# EAGLE design wire (EAGLE 6.5.0)
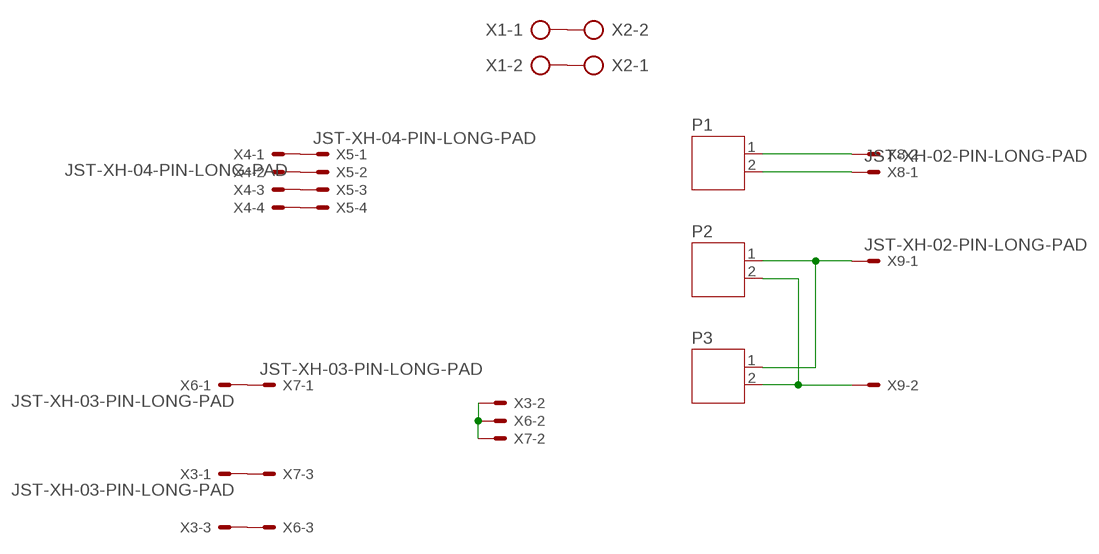
[diagram p0: schematic, sheet 1]

## Parts
P1  JST-PH2  [JST-PH2]
P2  JST-PH2  [JST-PH2]
P3  JST-PH2  [JST-PH2]
X1  AK500/2  [AK500/2]
X2  AK500/2  [AK500/2]
X3  JST-XH-03-PIN-LONG-PAD  [JST-XH-03-PACKAGE-LONG-PAD]
X4  JST-XH-04-PIN-LONG-PAD  [JST-XH-04-PACKAGE-LONG-PAD]
X5  JST-XH-04-PIN-LONG-PAD  [JST-XH-04-PACKAGE-LONG-PAD]
X6  JST-XH-03-PIN-LONG-PAD  [JST-XH-03-PACKAGE-LONG-PAD]
X7  JST-XH-03-PIN-LONG-PAD  [JST-XH-03-PACKAGE-LONG-PAD]
X8  JST-XH-02-PIN-LONG-PAD  [JST-XH-02-PACKAGE-LONG-PAD]
X9  JST-XH-02-PIN-LONG-PAD  [JST-XH-02-PACKAGE-LONG-PAD]

## Nets
N$1: X4.1 X5.1
N$2: P2.1 P3.1 X9.1
N$3: X4.2 X5.2
N$4: X4.3 X5.3
N$5: X4.4 X5.4
N$6: P2.2 P3.2 X9.2
N$7: X1.1 X2.2
N$8: X1.2 X2.1
N$11: P1.1 X8.2
N$12: P1.2 X8.1
N$13: X6.1 X7.1
N$14: X3.2 X6.2 X7.2
N$15: X3.1 X7.3
N$16: X3.3 X6.3

## Library data of the parts
P1-P3 = jst-ph:JST-PH2
X1 X2 = con-ptr500:AK500/2: CONNECTOR; OC_FARNELL: unknown; OC_NEWARK: unknown
X3 X6 X7 = Rembrandt Electronics - JST XH Connectors v1-0:JST-XH-03-PIN: JST XH Connector 2 Pin Wire to board connector. Pitch: 2,54 mm, (0.100") Number of pins: 3 Created by Rembrandt Electronics www.rembrandtelectronics.com
X4 X5 = Rembrandt Electronics - JST XH Connectors v1-0:JST-XH-04-PIN: JST XH Connector 2 Pin Wire to board connector. Pitch: 2,54 mm, (0.100") Number of pins: 4 Created by Rembrandt Electronics www.rembrandtelectronics.com
X8 X9 = Rembrandt Electronics - JST XH Connectors v1-0:JST-XH-02-PIN: JST XH Connector 2 Pin Wire to board connector. Pitch: 2,54 mm, (0.100") Number of pins: 2 Created by Rembrandt Electronics www.rembrandtelectronics.com

## Board
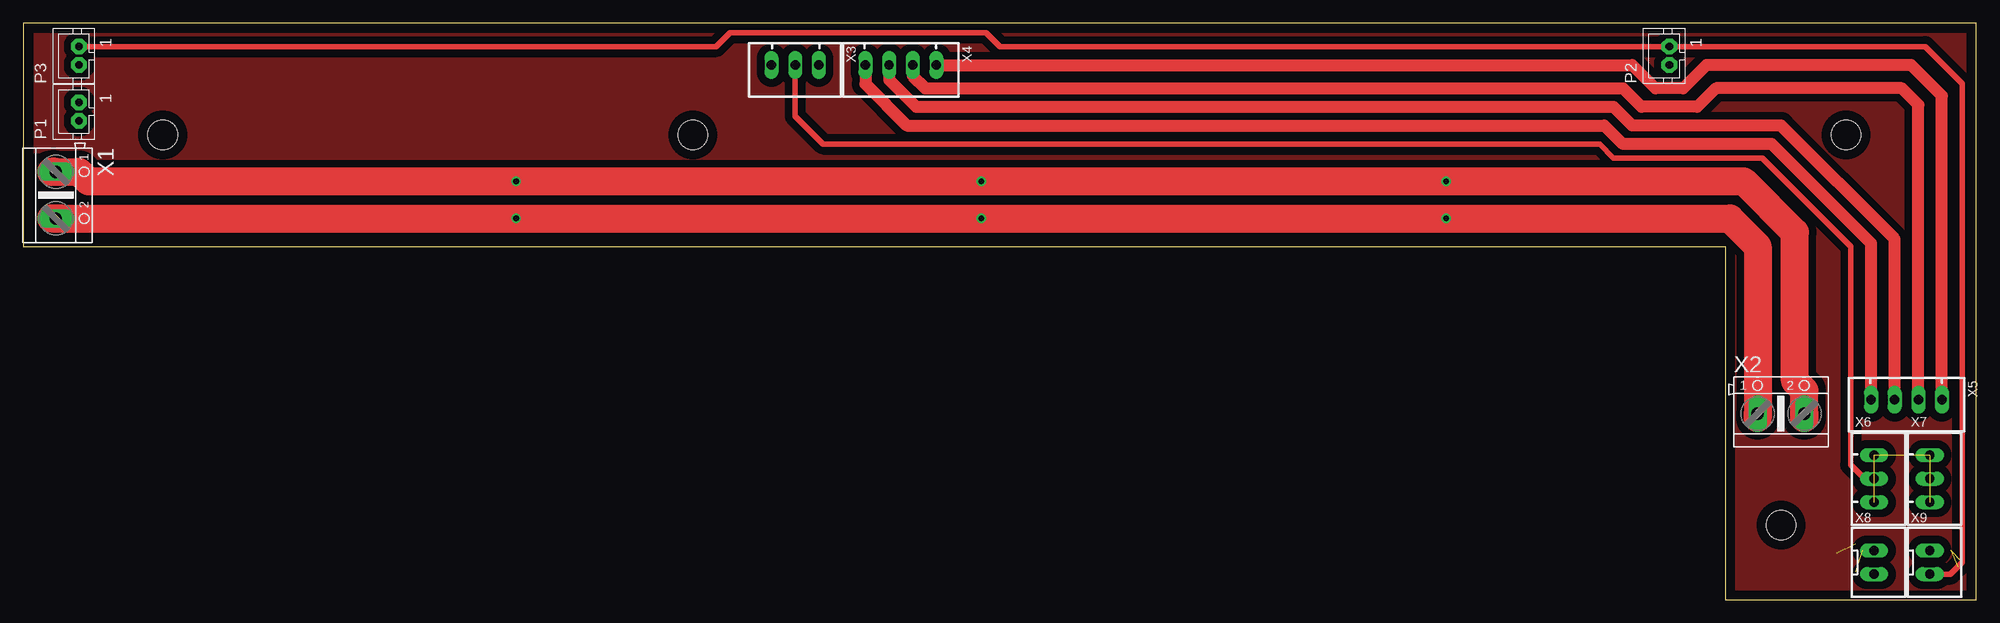
[diagram p1: board, top side]
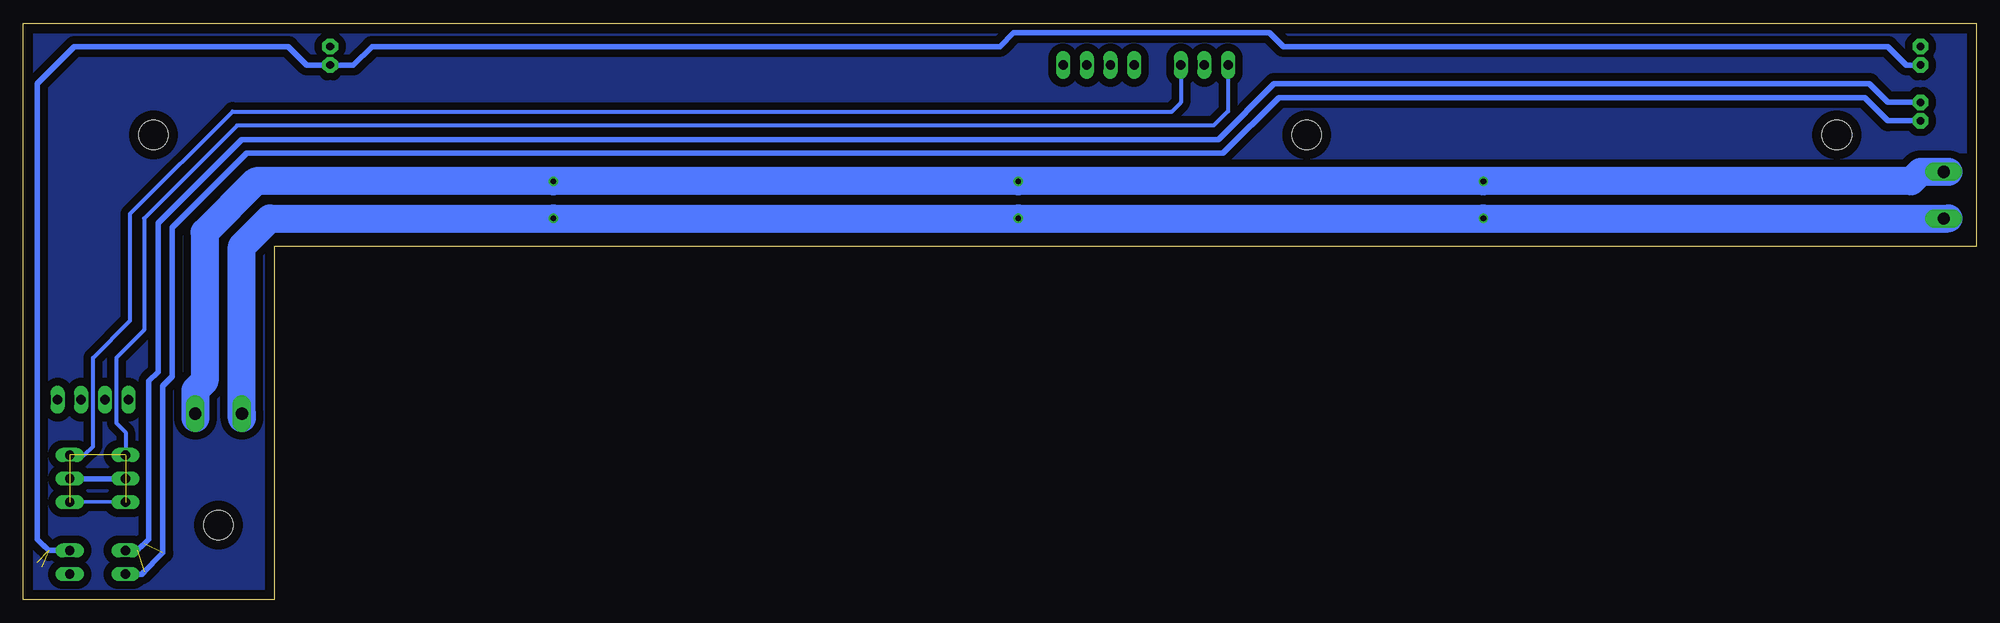
[diagram p2: board, bottom side, seen from below]

Size 210 x 62 mm. Coordinates in mm from the lower left corner, seen from the top.
Outline: 0,38 183,38 183,0 210,0 210,62 0,62 0,38
Copper layers (1*16): Top 0.035mm / dielectric 1.5mm / Bottom 0.035mm
Design rules "default": minimum track width 10mil, minimum drill 24mil, track to track 8mil, track to pad 8mil, pad to pad 8mil, via to via 8mil, smd to smd 8mil, copper to edge 40mil, drill to drill 8mil, minimum pad ring 10mil, minimum via ring 8mil, stop-mask expansion 4mil, vias tented up to drill 0mil, thermal gap 10mil
Holes 3.2 mm at 196,50 15,50 72,50 189,8

### Footprints (pad centres in the part's own frame; a part is rotated, then mirrored left to right if it is on the bottom)
JST-PH2 = drill 0.813 pad 1.676 octagon: 1 1,0; 2 -1,0
AK500/2 = drill 1.321 long: 1 -2.515,0; 2 2.515,0
JST-XH-03-PACKAGE-LONG-PAD = drill 1.016 long: 1 -2.54,0; 2 0,0; 3 2.54,0
JST-XH-04-PACKAGE-LONG-PAD = drill 1.016 long: 1 -3.81,0; 2 -1.27,0; 3 1.27,0; 4 3.81,0
JST-XH-02-PACKAGE-LONG-PAD = drill 1.016 long: 1 -1.27,0; 2 1.27,0

### Placement (x,y rotation side)
P1  6,52.5 90 top
P2  177,58.5 90 top
P3  6,58.5 90 top
X1  3.5,43.5 270 top
X2  189,20 0 top
X3  83,57.5 180 top
X4  94.36,57.5 180 top
X5  202.5,21.5 180 top
X6  199,13 270 top
X7  205,13 270 top
X8  199,4 270 top
X9  205,4 270 top

### Tracks (layer width: path | path; a pad name or v marks a point on that pad's centre or on a via)
N$1
  Top 1.27: X4.1 173,57.5 175.5,55 178.5,55 181,57.5 203,57.5 206.31,54.19 X5.1
N$2  (1 unrouted)
  Top 0.61: P3.1 74.5,59.5 76,61 103.5,61 105,59.5 P2.1 204.5,59.5 208.5,55.5 208.5,4 207.23,2.73
  Bottom 0.61: X9.1 207.27,5.27 208,6
N$3
  Top 1.27: X5.2 203.77,53.23 202,55 182,55 180,53 174,53 172,55 97,55 95.64,56.36 X4.2
N$4
  Top 1.27: X4.3 93.09,55.91 96,53 171,53 173,51 189,51 201.23,38.77 X5.3
N$5
  Top 1.27: X4.4 90.56,55.45 95,51 170,51 172,49 188,49 198.69,38.31 X5.4
N$6  (1 unrouted)
  Top 0.61: X9.2 207.23,2.73 208,3.5
  Bottom 0.61: P3.2 7.5,57.5 9.5,59.5 74.5,59.5 76,61 103.5,61 105,59.5 172.5,59.5 174.5,57.5 P2.2 179.5,57.5 181.5,59.5 204.5,59.5 208.5,55.5 208.5,6.5 207.27,5.27
N$7
  Top 3: X1.1 3.02,46.02 3,46 5.99,46.02 7,45 184.99,45.02 190.51,39.48 190.5,23.5 191.51,22.48 191.51,19.52 191.5,19.5 X2.2
N$8
  Top 3: X1.2 183.51,40.98 186.5,38 186.5,19.5 186.5,20.02 X2.1
N$11  (1 unrouted)
  Bottom 0.61: P1.1 9.5,53.5 11.5,55.5 75.5,55.5 81.5,49.5 186.5,49.5 195.5,40.5 195.5,24.5 196.5,23.5 196.5,6.5 197.73,5.27 | X8.2 197.27,2.73 197,3
N$12  (1 unrouted)
  Bottom 0.61: P1.2 9.5,51.5 12,54 75,54 81,48 186,48 194,40 194,24 195,23 195,5 197.27,2.73 | X8.1 197.73,5.27 197,6
N$13  (1 unrouted)
N$14
  Top 0.61: X3.2 83,52 86,49 169.5,49 171,47.5 187,47.5 196.5,38 196.5,14.5 198,13 X6.2
  Bottom 0.61: X6.2 X7.2
N$15  (1 unrouted)
  Bottom 0.406: X3.1 85.54,53.46 86.5,52.5 187.5,52.5 198.5,41.5 198.5,30 202.5,26 202.5,16.5 203.5,15.5 205,15.5
N$16  (1 unrouted)
  Bottom 0.406: X3.3 80.46,52.54 82,51 187,51 197,41 197,29 200,26 200,19 199,18 199,15.5 | X6.3 205,10.5
N$17  (via drill 0.6)
  Bottom 3: 3,46 6,46 7,45 v53,45 v103,45 v153,45 185,45 190.5,39.5 190.5,23.5 191.5,22.5 191.5,19.5
N$18  (via drill 0.6)
  Bottom 3: 186.5,20 186.5,19.5 186.5,38 183.5,41 v153,41 v103,41 v53,41 3,41
N$19
  Top 3: 3,41 4,41
N$20
  pour Top (isolate 0.813): 1,61 1,48 7,48 7,39 184,39 184,1 209,1 209,61
N$21
  pour Bottom (isolate 0.813): 1,61 1,48 7,48 7,39 184,39 184,1 209,1 209,61

### Text on the board
tOrigins: Cooling Fan | Cooling Fan | X/Z End Stop | X motor | Temp Sensor | TinyBoy2 (L10) Wire Board | Heater | Heater | X motor | Z min | X max | Fan | Temp